# Altium schematic sheet 螺丝孔_1.schdoc
size 127 x 101 mm
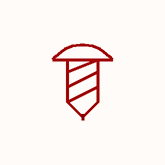
[diagram p0: 螺丝孔_1.schdoc]

## Parts
?  螺丝孔_1  (value not drawn)

## Nets

Not connected (* = marked no-connect by the designer): ? 1